# EAGLE design ChairControlInterceptor (EAGLE 8.6.0)
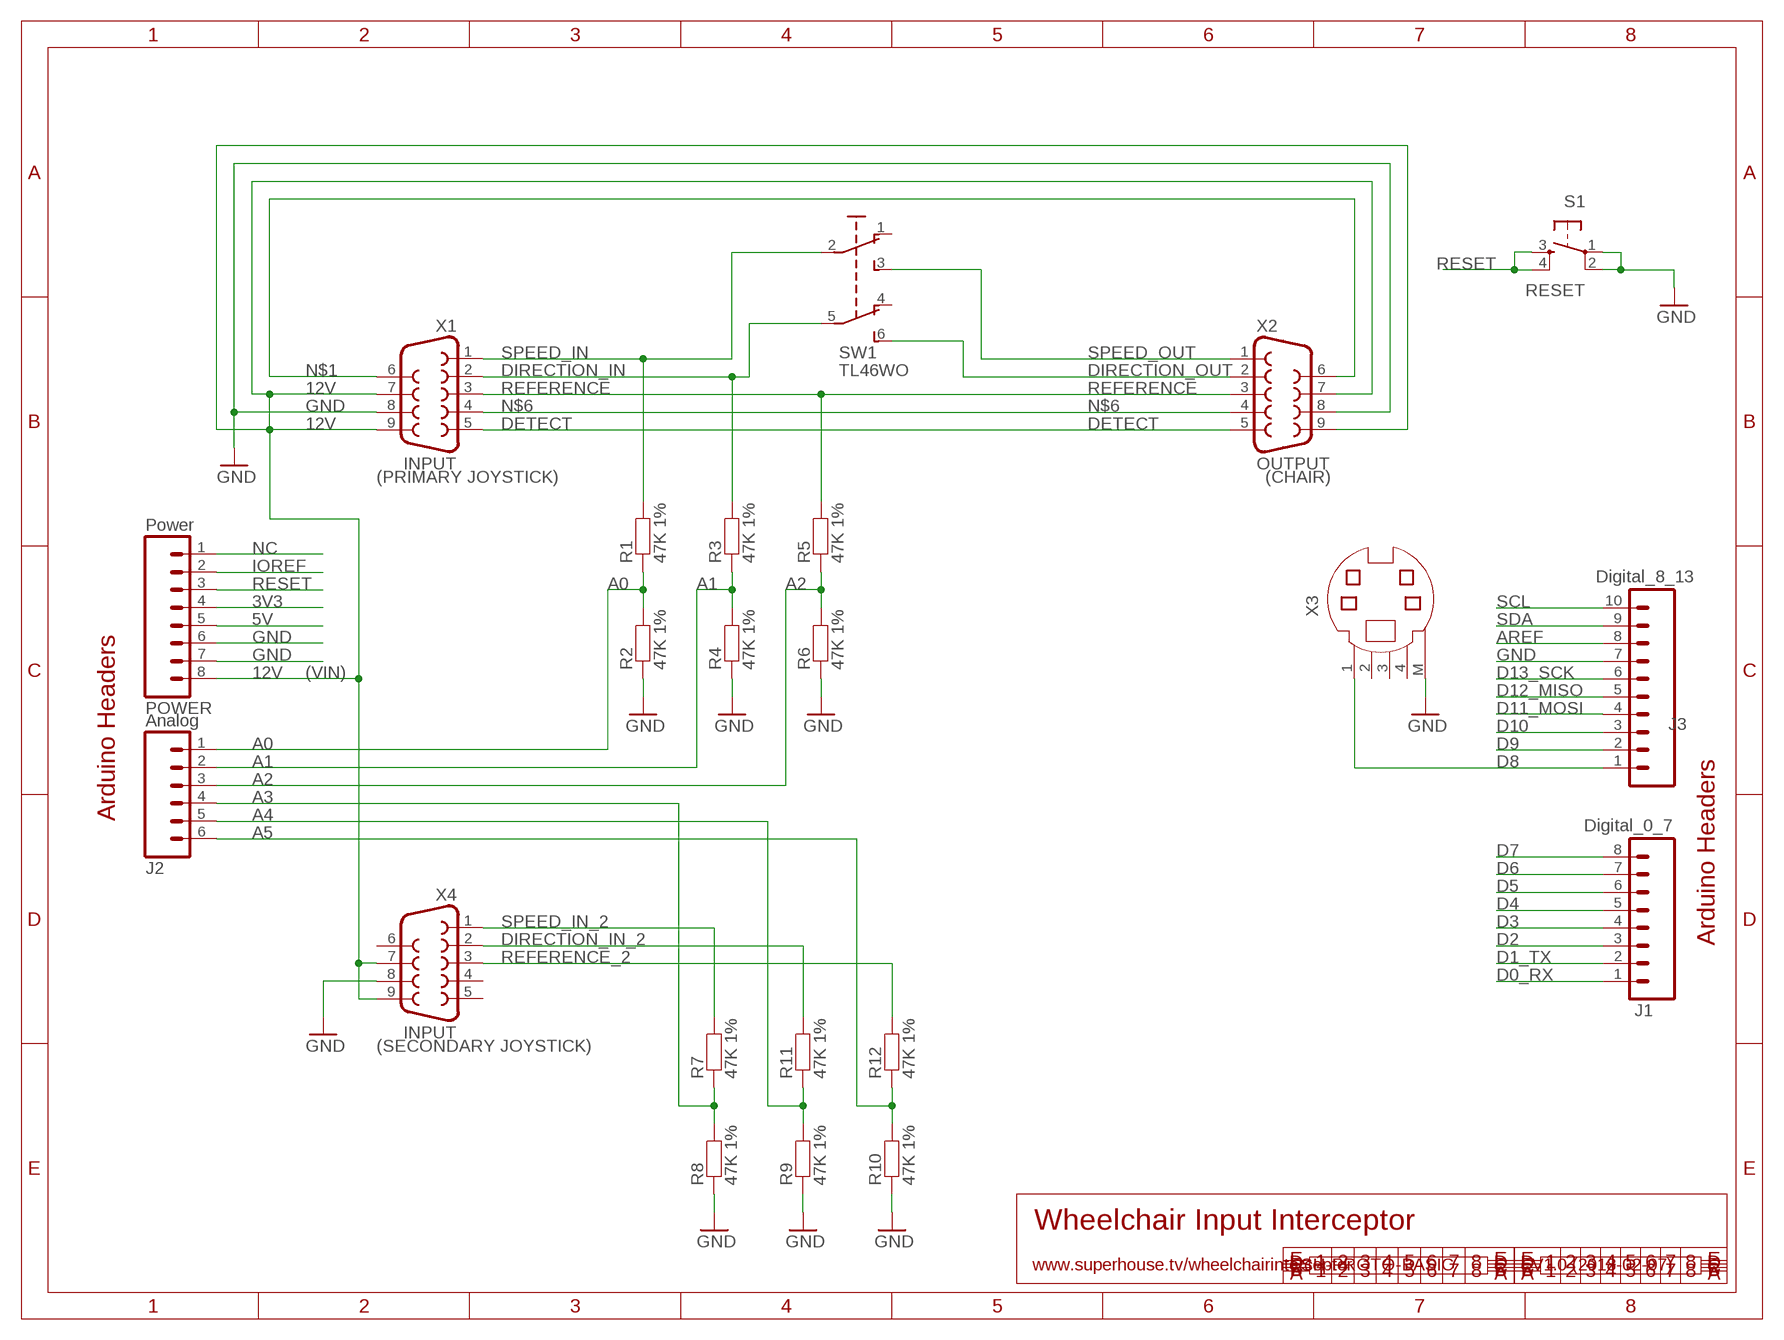
[diagram p0: schematic, sheet 1]

## Parts
J1  Digital_0_7  M08  [1X08]
J2  Analog  M06SIP  [1X06]
J3  Digital_8_13  M100.1  [1X10]
POWER  Power  M08  [1X08]
R1  47K 1%  RESISTOR0603  [0603]
R2  47K 1%  RESISTOR0603  [0603]
R3  47K 1%  RESISTOR0603  [0603]
R4  47K 1%  RESISTOR0603  [0603]
R5  47K 1%  RESISTOR0603  [0603]
R6  47K 1%  RESISTOR0603  [0603]
R7  47K 1%  RESISTOR0603  [0603]
R8  47K 1%  RESISTOR0603  [0603]
R9  47K 1%  RESISTOR0603  [0603]
R10  47K 1%  RESISTOR0603  [0603]
R11  47K 1%  RESISTOR0603  [0603]
R12  47K 1%  RESISTOR0603  [0603]
S1  RESET  TAC_SWITCHPTH  [TACTILE-PTH]
SW1  TL46WO  [TL4XWO]
X1  INPUT  DB9MALE  [DB9_MALE]
X2  OUTPUT  DB9FEMALE  [DB9]
X3  MD04S  [MDIN04S]
X4  INPUT  DB9MALE  [DB9_MALE]

## Nets
3V3: POWER.4
5V: POWER.5
12V: POWER.8 X1.7 X1.9 X2.7 X2.9 X4.7 X4.9
A0: J2.1 R1.1 R2.2
A1: J2.2 R3.1 R4.2
A2: J2.3 R5.1 R6.2
A3: J2.4 R7.1 R8.2
A4: J2.5 R9.2 R11.1
A5: J2.6 R10.2 R12.1
AREF: J3.8
D0_RX: J1.1
D1_TX: J1.2
D2: J1.3
D3: J1.4
D4: J1.5
D5: J1.6
D6: J1.7
D7: J1.8
D8: J3.1 X3.1
D9: J3.2
D10: J3.3
D11_MOSI: J3.4
D12_MISO: J3.5
D13_SCK: J3.6
DETECT: X1.5 X2.5
DIRECTION_IN: R3.2 SW1.5(P1) X1.2
DIRECTION_IN_2: R11.2 X4.2
DIRECTION_OUT: SW1.6(S1) X2.2
GND: J3.7 POWER.6 POWER.7 R2.1 R4.1 R6.1 R8.1 R9.1 R10.1 S1.1 S1.2 X1.8 X2.8 X3.M X4.8
IOREF: POWER.2
N$1: X1.6 X2.6
N$6: X1.4 X2.4
NC: POWER.1
REFERENCE: R5.2 X1.3 X2.3
REFERENCE_2: R12.2 X4.3
RESET: POWER.3 S1.3 S1.4
SCL: J3.10
SDA: J3.9
SPEED_IN: R1.2 SW1.2(P) X1.1
SPEED_IN_2: R7.2 X4.1
SPEED_OUT: SW1.3(S) X2.1
Unconnected: SW1.1(O) SW1.4(O1) X3.2 X3.3 X3.4 X4.4 X4.5 X4.6

## Notes on the sheet
- (PRIMARY JOYSTICK) | (CHAIR)
- (VIN)
- Arduino Headers
- Arduino Headers
- (SECONDARY JOYSTICK)
- Wheelchair Input Interceptor
- www.superhouse.tv/wheelchairinterceptor | SH-PROTO-BASIC | V1.0 (2018-02-07)

## Library data of the parts
J1 = freetronics:M08: Header 8 Standard 8-pin 0.1" header. Use with straight break away headers (SKU : PRT-00116), right angle break away headers (PRT-00553), swiss pins (PRT-00743), machine pins (PRT-00117), and female headers (PRT-00115).
J2 = freetronics:M06: Header 6 Standard 6-pin 0.1" header. Use with straight break away headers (SKU : PRT-00116), right angle break away headers (PRT-00553), swiss pins (PRT-00743), machine pins (PRT-00117), and female headers (PRT-00115). Molex polarized connector foot print use with SKU : PRT-08094 with associated crimp pins and housings. NOTES ON THE VARIANTS LOCK and LOCK_LONGPADS... This footprint was designed to help hold the alignment of a through-hole component (i.e. 6-pin header) while soldering it into place. You may notice that each hole has been shifted either up or down by 0.005 of an inch from it's more standard position (which is a perfectly straight line). This slight alteration caused the pins (the squares in the middle) to touch the edges of the holes. Because they are alternating, it causes a "brace" to hold the component in place. 0.005 has proven to be the perfect amount of "off-center" position when using our standard breakaway headers. Although looks a little odd when you look at the bare footprint, once you have a header in there, the alteration is very hard to notice. Also, if you push a header all the way into place, it is covered up entirely on the bottom side. This idea of altering the position of holes to aid alignment will be further integrated into the Sparkfun Library for other footprints. It can help hold any component with 3 or more connection pins.
J3 = freetronics-original:M10: Header 10 Standard 10-pin 0.1" header. Use with straight break away headers (SKU : PRT-00116), right angle break away headers (PRT-00553), swiss pins (PRT-00743), machine pins (PRT-00117), and female headers (PRT-00115).
POWER = freetronics-original:M08: Header 8 Standard 8-pin 0.1" header. Use with straight break away headers (SKU : PRT-00116), right angle break away headers (PRT-00553), swiss pins (PRT-00743), machine pins (PRT-00117), and female headers (PRT-00115).
R1-R12 = freetronics-jon:RESISTOR: Resistor Basic schematic elements and footprints for 0603, 1206, and PTH 1/10th watt (small) resistors.
S1 = freetronics:TAC_SWITCH: Momentary Switch Button commonly used for reset or general input. Spark Fun Electronics SKU : COM-00097
SW1 = switch:TL46WO: TINY SWITCH ON - ON Source: http://www2.produktinfo.conrad.com/datenblaetter/700000-724999/705152-da-01-de-Subminiaturschalter_TL_36WO.pdf
X1 X2 X4 = SparkFun-Connectors:DB9: DB9 Connector Standard DB9 (D-Sub 9) serial connector. Can be used for CAN bus as well as RS485 and RS232. Footprint production proven. Spark Fun Electronics SKU : PRT-00429
X3 = freetronics-jon:MD04S: YAMAICHI CONNECTOR; OC_FARNELL: unknown; OC_NEWARK: unknown

## Board
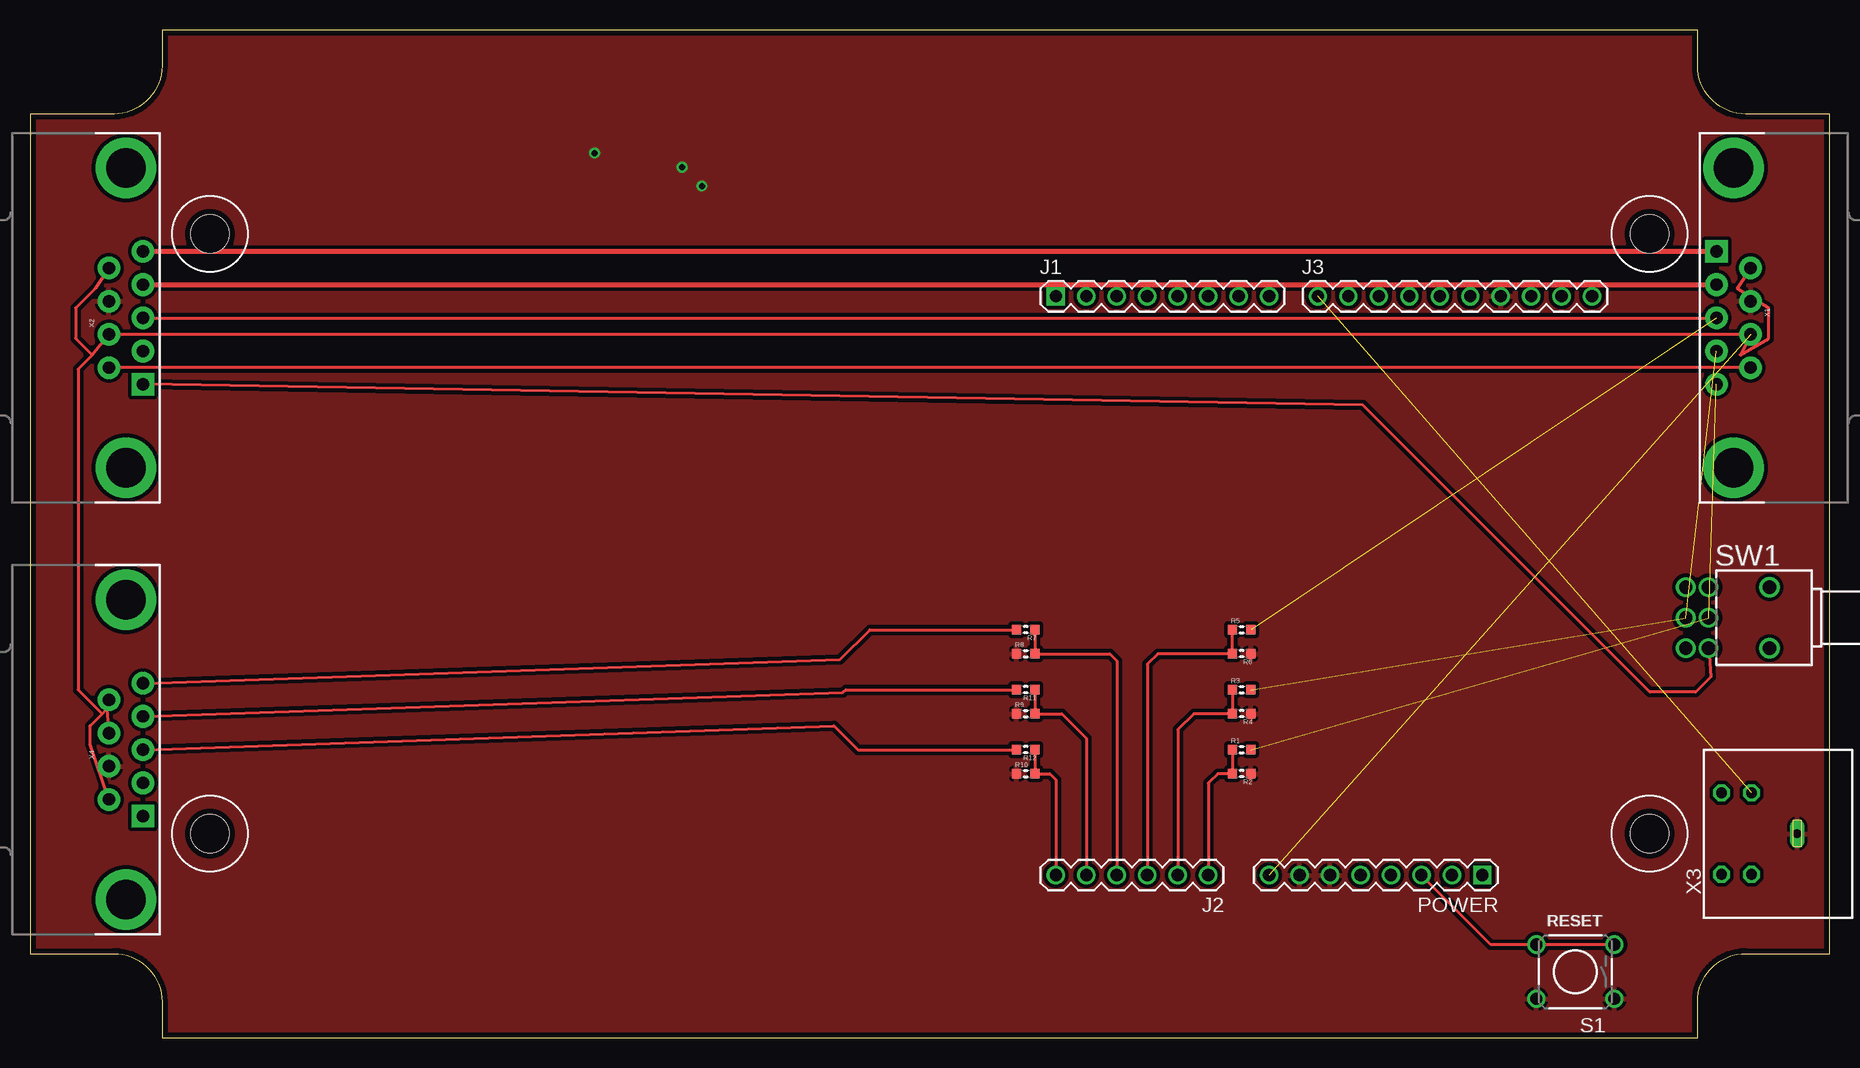
[diagram p1: board, top side]
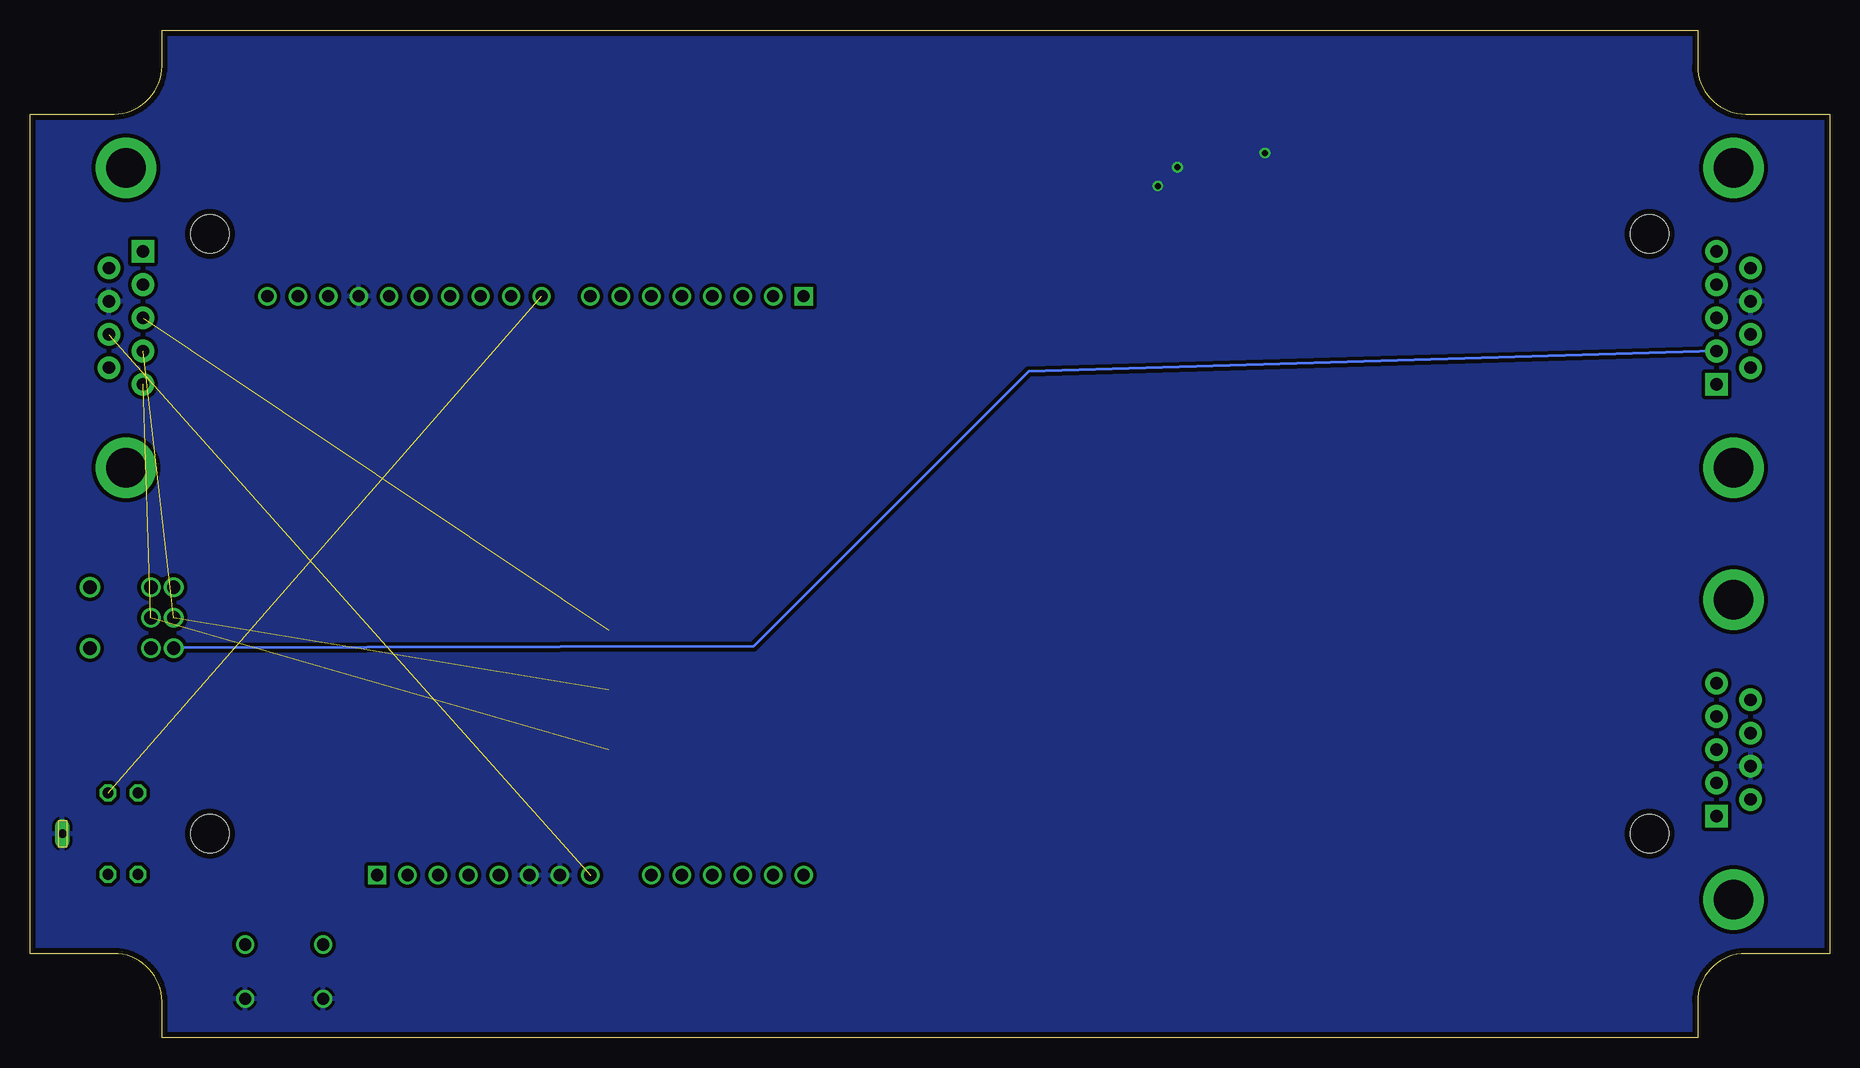
[diagram p2: board, bottom side, seen from below]

Size 150 x 84 mm. Coordinates in mm from the lower left corner, seen from the top.
Outline: 143,77 arc-90 139,81 139,84 11,84 11,81 arc-90 7,77 0,77 0,7 7,7 arc-90 11,3 11,0 139,0 139,3 arc-90 143,7 150,7 150,77 143,77
Copper layers (1*16): Top 0.035mm / dielectric 1.5mm / Bottom 0.035mm
Design rules "default *": minimum track width 10mil, minimum drill 24mil, track to track 12mil, track to pad 12mil, pad to pad 12mil, via to via 12mil, smd to smd 8mil, copper to edge 18mil, drill to drill 8mil, minimum pad ring 10mil, minimum via ring 8mil, stop-mask expansion 4mil, vias tented up to drill 0mil, thermal gap 10mil
Holes 3.2 mm at 15,67 15,17 135,67 135,17

### Footprints (pad centres in the part's own frame; a part is rotated, then mirrored left to right if it is on the bottom)
1X08 = drill 1.016 square: 1 0,0 | drill 1.016: 2 2.54,0; 3 5.08,0; 4 7.62,0; 5 10.16,0; 6 12.7,0; 7 15.24,0; 8 17.78,0
1X06 = drill 1.016: 1 0,0; 2 2.54,0; 3 5.08,0; 4 7.62,0; 5 10.16,0; 6 12.7,0
1X10 = drill 1.016: 1 0,0; 2 2.54,0; 3 5.08,0; 4 7.62,0; 5 10.16,0; 6 12.7,0; 7 15.24,0; 8 17.78,0; 9 20.32,0; 10 22.86,0
0603 = smd 0.762 x 0.762: 1 -0.762,0; 2 0.762,0
TACTILE-PTH = drill 1.016: 1 -3.251,2.261; 2 3.251,2.261; 3 -3.251,-2.261; 4 3.251,-2.261
TL4XWO = drill 1.1 pad 1.422: 1 -2.54,-5.08; 2 0,-5.08; 3 2.54,-5.08; 4 -2.54,-6.985; 5 0,-6.985; 6 2.54,-6.985 | drill 1.1 pad 1.676: M1 -2.54,0; M2 2.54,0
DB9_MALE = drill 1.016 pad 1.88: 1 5.54,-1.42; 2 2.77,-1.42; 3 0,-1.42; 4 -2.77,-1.42; 6 4.15,1.42; 7 1.38,1.42; 8 -1.38,1.42; 9 -4.15,1.42 | drill 1.016 pad 1.88 square: 5 -5.54,-1.42 | drill 3.302 pad 5.08: G1 -12.5,0; G2 12.5,0
DB9 = drill 1.016 pad 1.88 square: 1 -5.54,-1.42 | drill 1.016 pad 1.88: 2 -2.77,-1.42; 3 0,-1.42; 4 2.77,-1.42; 5 5.54,-1.42; 6 -4.15,1.42; 7 -1.38,1.42; 8 1.38,1.42; 9 4.15,1.42 | drill 3.302 pad 5.08: G1 -12.5,0; G2 12.5,0
MDIN04S = drill 0.9 octagon: 1 3.4,8.5; 2 -3.4,8.5; 3 3.4,11; 4 -3.4,11 | drill 0.7 long: M 0,4.7

### Placement (x,y rotation side)
J1  85.51,61.8 0 top
J2  98.21,13.54 180 top
J3  107.35,61.8 0 top
POWER  121.07,13.54 180 top
R1  101,24 0 top
R2  101,22 180 top
R3  101,29 0 top
R4  101,27 180 top
R5  101,34 0 top
R6  101,32 180 top
R7  83,34 180 top
R8  83,32 0 top
R9  83,27 0 top
R10  83,22 0 top
R11  83,29 180 top
R12  83,24 180 top
S1  128.82,5.49 180 top
SW1  145,35 270 top
X1  142,60 270 top
X2  8,60 90 top
X3  152,17 90 top
X4  8,24 90 top

### Tracks (layer width: path | path; a pad name or v marks a point on that pad's centre or on a via)
12V  (1 unrouted)
  Top 0.254: 5.19,56.91 X2.7 X1.7 142.55,56.91 144.93,58.29 144.93,60.83 142.32,62.44 X1.9 | 5.19,56.91 3.81,58.29 3.81,60.83 5.42,62.44 X2.9 | X4.9 5,24.43 5,26 6,27 | 6,27 6.38,27.38 X4.7 | 5.19,56.91 4,55.72 4,29 6,27
A0
  Top 0.254: R1.1 R2.2 99,22 98.21,21.21 J2.1
A1
  Top 0.254: R3.1 R4.2 97,27 95.67,25.67 J2.2
A2
  Top 0.254: R5.1 R6.2 94,32 93.13,31.13 J2.3
A3
  Top 0.254: R7.1 R8.2 90,32 90.59,31.41 J2.4
A4
  Top 0.254: R11.1 R9.2 86,27 88.05,24.95 J2.5
A5
  Top 0.254: R12.1 R10.2 85,22 85.51,21.49 J2.6
D8  (1 unrouted)
DETECT
  Top 0.406: X1.5 X2.5
DIRECTION_IN  (2 unrouted)
DIRECTION_IN_2
  Top 0.254: X4.2 67.77,28.77 68,29 R11.2
DIRECTION_OUT
  Bottom 0.254: X2.2 66.79,55.52 89.69,32.62 SW1.6
GND  (via drill 0.5)
  other vias: 56,71 54.34,72.56 47.07,73.75
  pour Bottom: 143,7 arc90 139,3 139,0 11,0 11,3 arc90 7,7 0,7 0,77 7,77 arc90 11,81 11,84 139,84 139,81 arc90 143,77 150,77 150,7
  pour Top: 143,7 arc90 139,3 139,0 11,0 11,3 arc90 7,7 0,7 0,77 7,77 arc90 11,81 11,84 139,84 139,81 arc90 143,77 150,77 150,7
N$1
  Top 0.254: X1.6 X2.6
N$6
  Top 0.406: X2.4 X1.4
REFERENCE  (1 unrouted)
  Top 0.254: X2.3 X1.3
REFERENCE_2
  Top 0.254: X4.3 67,26 69,24 R12.2
RESET
  Top 0.254: S1.3 S1.4 121.78,7.75 POWER.3
SPEED_IN  (2 unrouted)
SPEED_IN_2
  Top 0.254: X4.1 67.54,31.54 70,34 R7.2
SPEED_OUT
  Top 0.254: SW1.3 140.12,30.08 138.85,28.81 135.04,28.81 111.1,52.75 X2.1

### Text on the board
tPlace: RESET